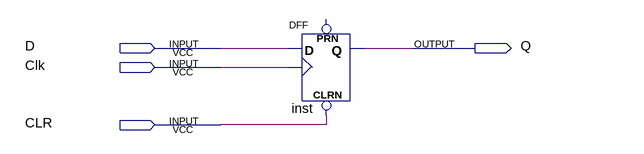
[diagram p0: schematic sheet]
// Quartus schematic CurrentState2.bdf as structural Verilog: 1 symbols, 4 pins
module CurrentState2 (
  input  D,
  input  Clk,
  input  CLR,
  output Q
);

  DFF inst (.CLRN(CLR), .CLK(Clk), .D(D), .Q(Q));  // open: PRN
endmodule
